# EAGLE schematic AVRPowerSupply-old (EAGLE 6.4)
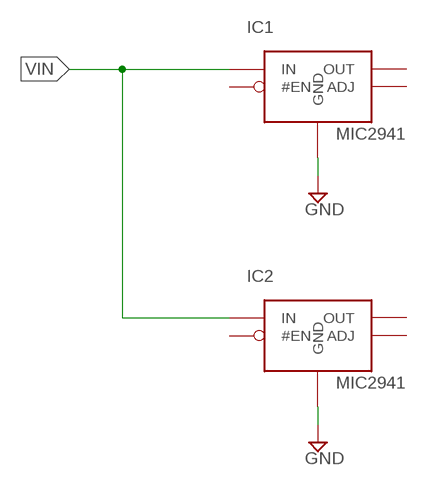
[diagram p0: schematic, sheet 1]

## Parts
IC1  BBSUP_MIC2941  [BBSUP_TO220-5]
IC2  BBSUP_MIC2941  [BBSUP_TO220-5]

## Nets
GND: IC1.3(GND) IC2.3(GND)
VIN: IC1.4(IN) IC2.4(IN)
Unconnected: IC1.1(ADJ) IC1.2(#EN) IC1.5(OUT) IC2.1(ADJ) IC2.2(#EN) IC2.5(OUT)

## Library data of the parts
IC1 IC2 = supply:BBSUP_MIC2941